# Altium schematic sheet Serial.SchDoc
size A; SheetNumber: 3; SheetTotal: 4
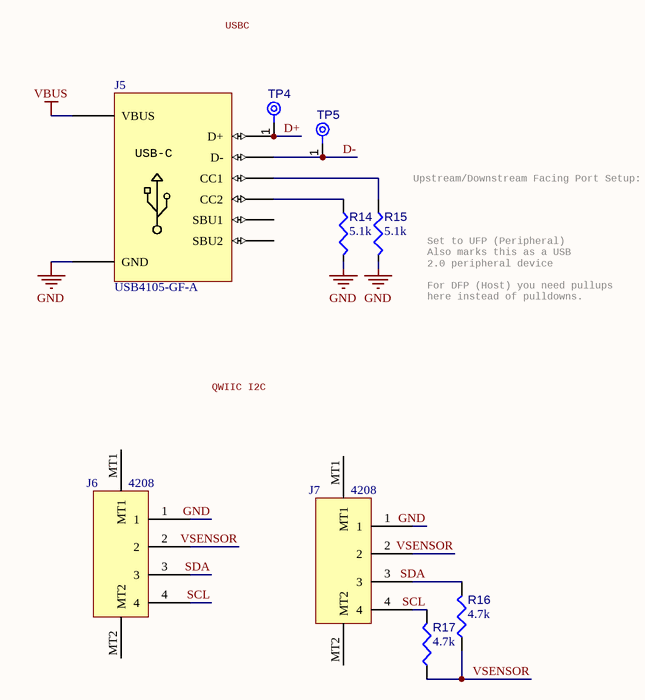
[diagram p0: Serial.SchDoc]

## Parts
J5  USB4105-GF-A  [USB4105-GF-A]
J6  4208  [4390]
J7  4208  [4390]
R14  value 5.1k  [RESC1608X55X25ML10T15]  (hidden comment: Resistor 5.1k +/-1% 0603 100 mW)
R15  value 5.1k  [RESC1608X55X25ML10T15]  (hidden comment: Resistor 5.1k +/-1% 0603 100 mW)
R16  value 4.7k  [RESC1608X55X25ML10T15]  (hidden comment: Resistor 4.7k +/-1% 0603 100 mW)
R17  value 4.7k  [RESC1608X55X25ML10T15]  (hidden comment: Resistor 4.7k +/-1% 0603 100 mW)
TP4  TPAD6R  [TP06R]  (value not drawn)  (no BOM)
TP5  TPAD6R  [TP06R]  (value not drawn)  (no BOM)

## Nets
GND: J5.A1B12,B1A12,M1,M2,M3,M4(GND) J6.1 J7.1 R14.2 R15.2
VBUS: J5.A4B9,B4A9(VBUS)
D+: J5.A6,B6(D+) TP4.1(TP)
D-: J5.A7,B7(D-) TP5.1(TP)
SCL: J6.4 J7.4 R17.2
SDA: J6.3 J7.3 R16.2
VSENSOR: J6.2 J7.2 R16.1 R17.1
NetJ5_A5: J5.A5(CC1) R15.1
NetJ5_B5: J5.B5(CC2) R14.1

Not connected (* = marked no-connect by the designer): J5 A8(SBU1) B8(SBU2); J6 MT1 MT2; J7 MT1 MT2

## Notes on the sheet
- USBC
- (near R15) Upstream/Downstream Facing Port Setup:
- (near R15) Set to UFP (Peripheral)
  Also marks this as a USB
  2.0 peripheral device
  For DFP (Host) you need pullups
  here instead of pulldowns.
- QWIIC I2C
- (in symbol CMP-013-000000-1) USB-C

## Library data of the parts
J5 = CMP-013-000000-1: USB-C 16-Pin Component; Source: USB4105-GF-A.SchLib; Design Item ID: USB4105-GF-A
J6 J7 = CMP-002-00080-4: Adafruit Accessories JST SH 4-pin Right Angle Connector (10-pack) - Qwiic Compatible; Manufacturer_Part_Number: 4208; Source: SamacSys.SchLib; Height: 7.05mm; Design Item ID: 4208; Manufacturer_Name: Adafruit; Datasheet Link: https://cdn-shop.adafruit.com/product-files/4390/4390_C13925-001_CCP-W20-04-BK-SMT-R-A.PDF
R14 R15 = CMP-009-00023-5: Chip Resistor, 5.1 KOhm, +/- 1%, 0.1 W, -55 to 155 degC, 0603 (1608 Metric); Voltage Rating: 50V; Power: 100mW; Max Operating Temperature: 155°C; RoHS Compliant: True; Tolerance: 1%; Pins: 2; Case/Package: 0603; Mounting Technology: SM; Min Operating Temperature: -55°C
R16 R17 = CMP-009-00023-5: Chip Resistor, 4.7 KOhm, +/- 1%, 0.1 W, -55 to 155 degC, 0603 (1608 Metric); Voltage Rating: 50V; Power: 100mW; Max Operating Temperature: 155°C; RoHS Compliant: True; Tolerance: 1%; Pins: 2; Case/Package: 0603; Mounting Technology: SM; Min Operating Temperature: -55°C
TP4 TP5 = CMP-00028-00002-2: 0.6mm round; Pins: 1